# Altium project OSP_Carrier_V7_Release.PrjPcb (part 2 of 2)

## Sheet OSP_Carrier_V7_Release_SD.SchDoc: OSP Full Carrier Board
size B; DrawnBy: LP; Revision: 1; SheetNumber: 3; SheetTotal: 7
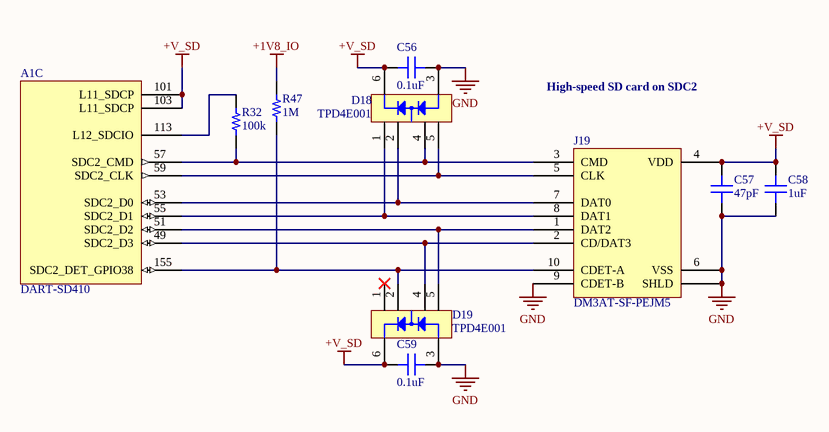
[diagram p5: OSP_Carrier_V7_Release_SD.SchDoc]

### Parts
A1  DART-SD410  [DART-SD410]  (part C of 15)
C56  0.1uF  [CAP 0402/1005]
C57  47pF  [CAP 0402/1005]
C58  1uF  [CAP 0603/1608]
C59  0.1uF  [CAP 0402/1005]
D18  TPD4E001  [TI_SOT-563_DRL]
D19  TPD4E001  [TI_SOT-563_DRL]
J19  DM3AT-SF-PEJM5  [HIROSE DM3AT-SF-PEJM5]
R32  100k  [RES 0402/1005]
R47  1M  [RES 0402/1005]

### Nets
+1V8_IO: R47.2
+V_SD: A1.101(L11_SDCP) A1.103(L11_SDCP) C56.2 C57.2 C58.2 C59.2 D18.6 D19.6 J19.4(VDD)
GND: C56.1 C57.1 C58.1 C59.1 D18.3 D19.3 J19.6(VSS) J19.9(CDET-B) J19.S(SHLD)
NetA1_49: A1.49(SDC2_D3) D19.4 J19.2(CD/DAT3)
NetA1_51: A1.51(SDC2_D2) D19.5 J19.1(DAT2)
NetA1_53: A1.53(SDC2_D0) D18.2 J19.7(DAT0)
NetA1_55: A1.55(SDC2_D1) D18.1 J19.8(DAT1)
NetA1_57: A1.57(SDC2_CMD) D18.4 J19.3(CMD) R32.1
NetA1_59: A1.59(SDC2_CLK) D18.5 J19.5(CLK)
NetA1_113: A1.113(L12_SDCIO) R32.2
NetA1_155: A1.155(SDC2_DET_GPIO38) D19.2 J19.10(CDET-A) R47.1

Not connected (* = marked no-connect by the designer): D19 1*

### Notes on the sheet
- High-speed SD card on SDC2
- Title
- Size:
- Date:
- B
- Revision:
- Time:
- Drawn By:
- Approved:
- Sheet
- of
- LACI
- Atkinson Hall, 5202
- UC San Diego
- 9500 Gilman Drive #0436
- La Jolla, CA 92093-0436
- File:

### Library data of the parts
A1 = DART-SD410: Variscite DART-SD410 System on Module
C56 C59 = C1005X7R1H104K050BB: CAP CER 0.1UF 50V X7R 0402; Manufacturer: TDK Corporation; TemperatureRange: -55C ~ 125C; Tolerance: 10%; Value: 0.1uF; Part Number: C1005X7R1H104K050BB; PartId: 3860; Supplier 1: Digi-Key; Supplier Part Number 1: 445-5932-2-ND; ComponentLink1Description: Datasheet; ComponentLink1URL: https://product.tdk.com/info/en/catalog/datasheets/mlcc_commercial_general_en.pdf; ComponentLink2Description: Digi-Key listing; ComponentLink2URL: http://digikey.com/product-detail/en/C1005X7R1H104K050BB/445-5932-2-ND/2443410; TemperatureCoefficient: X7R; Voltage: 50V; Price: 0.0287; Type: -; Device Package: 0402 (1005 Metric)
C57 = C1005C0G1H470G050BA: CAP CER 47PF 50V C0G 0402; Manufacturer: TDK Corporation; TemperatureRange: -55C ~ 125C; TemperatureCoefficient: C0G, NP0; Tolerance: 2%; Value: 47pF; Part Number: C1005C0G1H470G050BA; PartId: 3864; Supplier 1: Digi-Key; Supplier Part Number 1: 445-5364-2-ND; ComponentLink1Description: Datasheet; ComponentLink1URL: https://product.tdk.com/info/en/catalog/datasheets/mlcc_commercial_general_en.pdf; ComponentLink2Description: Digi-Key listing; ComponentLink2URL: http://digikey.com/product-detail/en/C1005C0G1H470G050BA/445-5364-2-ND/2269858; Voltage: 50V; Price: 0.1148; Type: -; Device Package: 0402 (1005 Metric)
C58 = C1608X7R1E105K080AB: CAP CER 1UF 25V X7R 0603; Manufacturer: TDK Corporation; TemperatureRange: -55C ~ 125C; Tolerance: 10%; Value: 1uF; Part Number: C1608X7R1E105K080AB; PartId: 4041; Supplier 1: Digi-Key; Supplier Part Number 1: 445-5956-1-ND; ComponentLink1Description: Datasheet; ComponentLink1URL: https://product.tdk.com/info/en/catalog/datasheets/mlcc_commercial_general_en.pdf; ComponentLink2Description: Digi-Key listing; ComponentLink2URL: http://digikey.com/product-detail/en/C1608X7R1E105K080AB/445-5956-1-ND/2443997; TemperatureCoefficient: X7R; Voltage: 25V; Price: 0.27; Type: -; Device Package: 0603 (1608 Metric)
D18 D19 = TI_TPD4E001: TI TPD4E001 4-channel TVS ESD protection diodes
J19 = DM3AT-SF-PEJM5: CONN MICRO SD CARD PUSH-PUSH R/A; Manufacturer: Hirose Electric Co Ltd; Number of Positions: 10 (8 + 2); Connector Type: Connector and Ejector; Part Number: DM3AT-SF-PEJM5; PartId: 9287; Supplier 1: Digi-Key; Supplier Part Number 1: HR1964TR-ND; ComponentLink1Description: Datasheet; ComponentLink1URL: http://www.hirose.co.jp/cataloge_hp/e60900232.pdf; ComponentLink2Description: Digi-Key Listing; ComponentLink2URL: http://www.digikey.ca/product-detail/en/DM3AT-SF-PEJM5/HR1964TR-ND/2533565; Price: 2.1114; Type: Connector and Ejector; Mounting Type: Surface Mount, Right Angle; Features: Switch; Contact Finish: Gold
R32 = ERJ-2RKF1003X: RES SMD 100K OHM 1% 1/10W 0402; Value: 1K; Part Number: ERJ-2RKF1003X
R47 = ERJ-2RKF1004X: RES SMD 1M OHM 1% 1/10W 0402; Manufacturer: Panasonic Electronic Components; TemperatureRange: -55C ~ 155C; TemperatureCoefficient: 100ppm/C; PowerRating: 0.1W, 1/10W; Value: 1M; Part Number: ERJ-2RKF1004X; PartId: 7; Supplier 1: Digi-Key; Supplier Part Number 1: P1.00MLTR-ND; ComponentLink1Description: Datasheet; ComponentLink1URL: http://industrial.panasonic.com/www-cgi/jvcr13pz.cgi?E+PZ+3+AOA0002+ERJ2RKF1004X+7+WW; ComponentLink2Description: Digikey listing; ComponentLink2URL: http://digikey.com/product-detail/en/ERJ-2RKF1004X/P1.00MLTR-ND/79728; Tolerance: 1%; Price: 0.0043; Type: Thick Film; Device Package: 0402 (1005 Metric)

## Nets that join several sheets
+1V8_IO: OSP_Carrier_V7_Release_Power (C62.1 U7.3), OSP_Carrier_V7_Release_DJB (7 pins), OSP_Carrier_V7_Release_Misc (7 pins), OSP_Carrier_V7_Release_SD (R47.2)
+3V3: OSP_Carrier_V7_Release_Power (6 pins), OSP_Carrier_V7_Release_DJB (R12.2 R18.2), OSP_Carrier_V7_Release_Misc (R5.1)
+3V3_F: OSP_Carrier_V7_Release_Power (17 pins), OSP_Carrier_V7_Release_DJB (29 pins)
+3V7: OSP_Carrier_V7_Release_Power (22 pins), OSP_Carrier_V7_Release_DJB (J2.A4 J2.B4 J3.A4 J3.B4), OSP_Carrier_V7_Release_PMIC_Audio (6 pins), OSP_Carrier_V7_Release_Misc (R43.2)
+5V_USB: OSP_Carrier_V7_Release_Power (D2.1), OSP_Carrier_V7_Release_USB (D1.6 J4.1 R30.2)
GND: OSP_Carrier_V7_Release_Power (81 pins), OSP_Carrier_V7_Release_DJB (30 pins), OSP_Carrier_V7_Release_USB (17 pins), OSP_Carrier_V7_Release_PMIC_Audio (14 pins), OSP_Carrier_V7_Release_Misc (15 pins), OSP_Carrier_V7_Release_SD (9 pins)
GPIO7: OSP_Carrier_V7_Release_DJB (U1.R5), OSP_Carrier_V7_Release_USB (A1.79)
GPIO17: OSP_Carrier_V7_Release_DJB (Q7.1), OSP_Carrier_V7_Release_Misc (A1.69)
GPIO31_CLK: OSP_Carrier_V7_Release_DJB (U1.T15), OSP_Carrier_V7_Release_Misc (A1.185)
GPIO62_INT: OSP_Carrier_V7_Release_DJB (U1.T6), OSP_Carrier_V7_Release_Misc (A1.160)
SPI1_CS2: OSP_Carrier_V7_Release_DJB (U1.T5), OSP_Carrier_V7_Release_Misc (A1.65)
SPI3_CLK: OSP_Carrier_V7_Release_DJB (A1.74 U1.R10), OSP_Carrier_V7_Release_Misc (U4.13)
SPI3_CS3: OSP_Carrier_V7_Release_DJB (U1.R6), OSP_Carrier_V7_Release_Misc (A1.152)
SPI3_MISO: OSP_Carrier_V7_Release_DJB (A1.72 U1.T9), OSP_Carrier_V7_Release_Misc (U4.1)
SPI3_MOSI: OSP_Carrier_V7_Release_DJB (A1.76 U1.T10), OSP_Carrier_V7_Release_Misc (U4.14)
SW_VOL+: OSP_Carrier_V7_Release_DJB (U1.P13), OSP_Carrier_V7_Release_Misc (A1.162 R44.1 SW1.1)